# Altium schematic sheet PHY.SchDoc: NanoBoard Ethernet Add-On
size C; DocumentNumber: 1; SheetNumber: 1; SheetTotal: 1
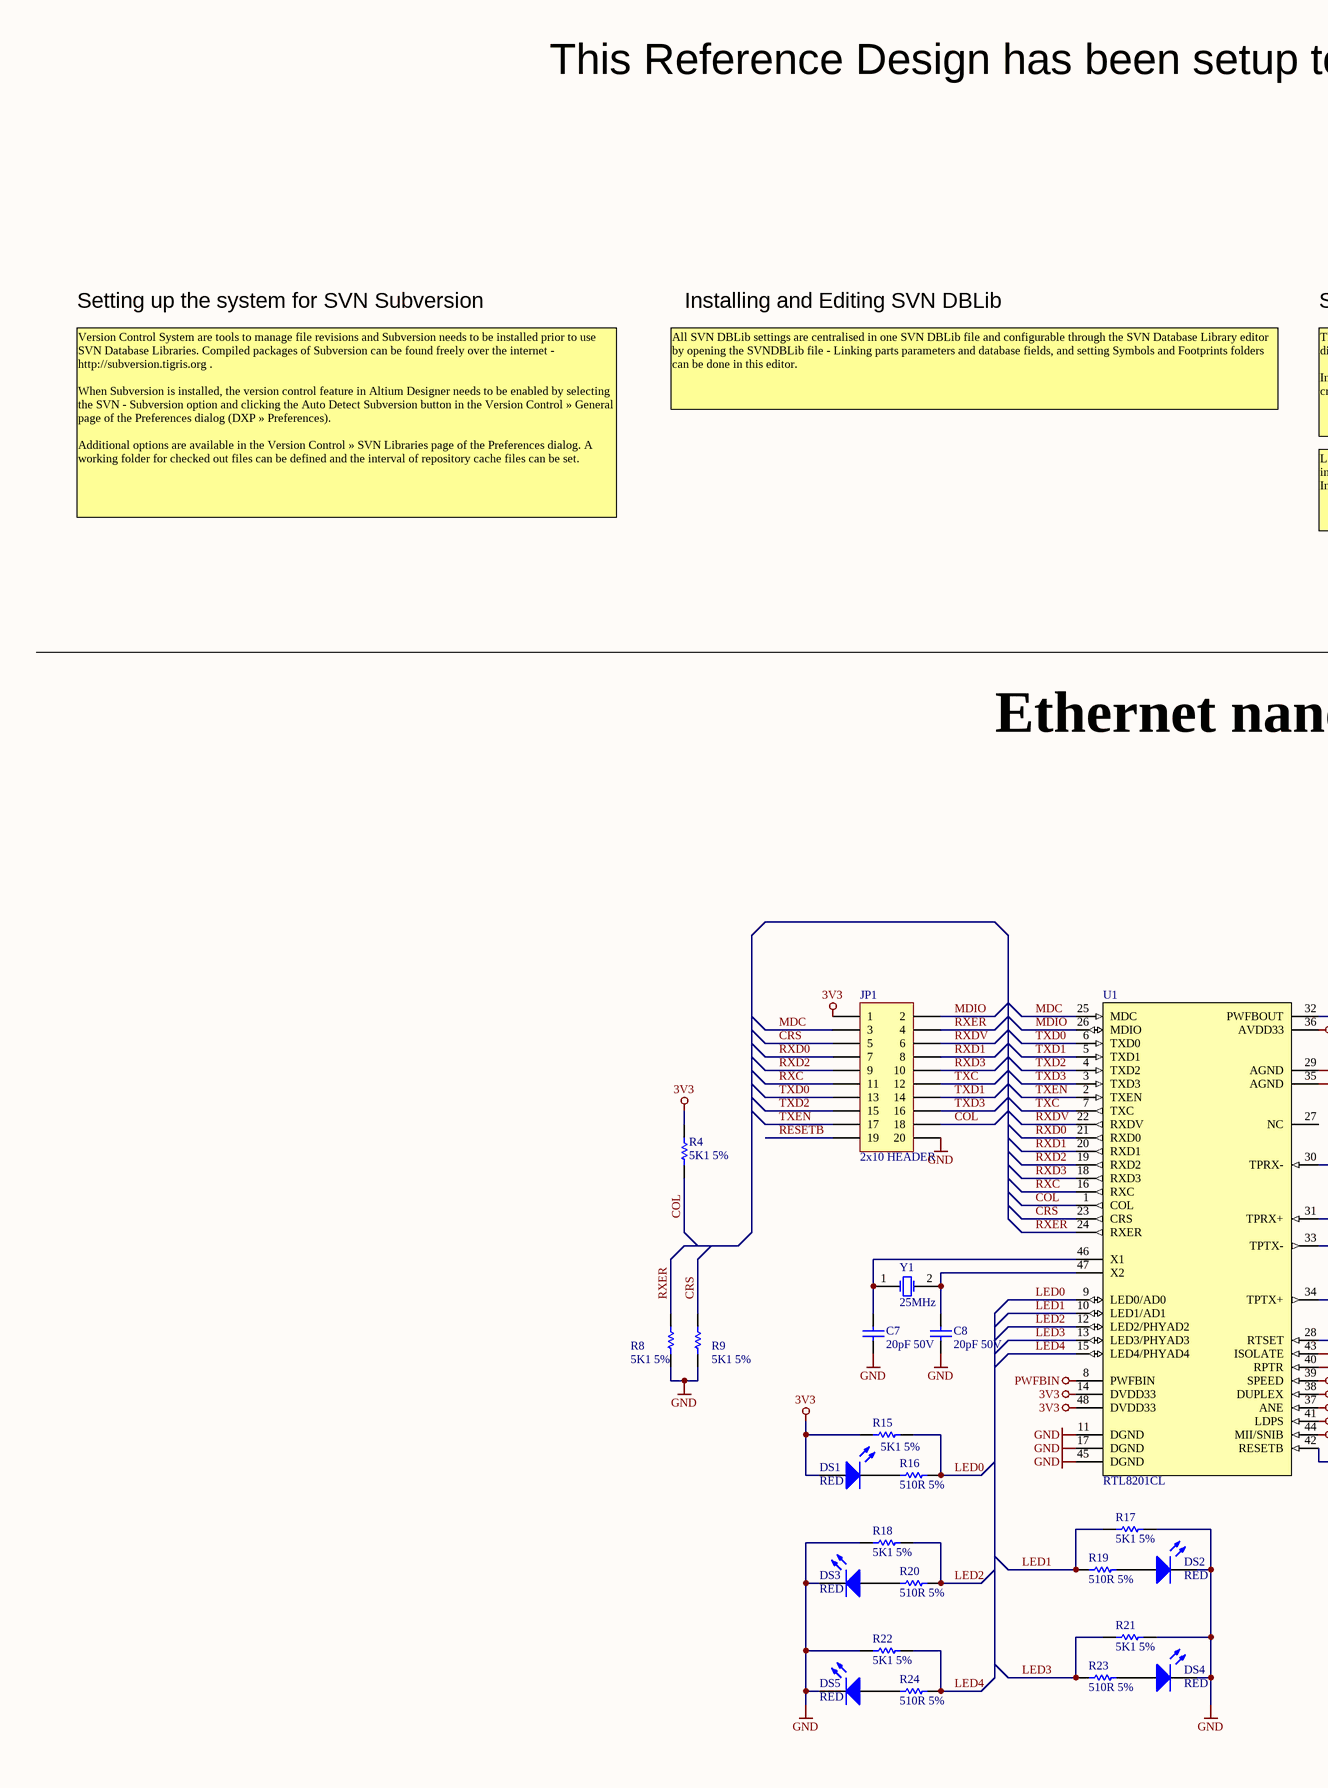
[diagram p0: PHY.SchDoc, left]
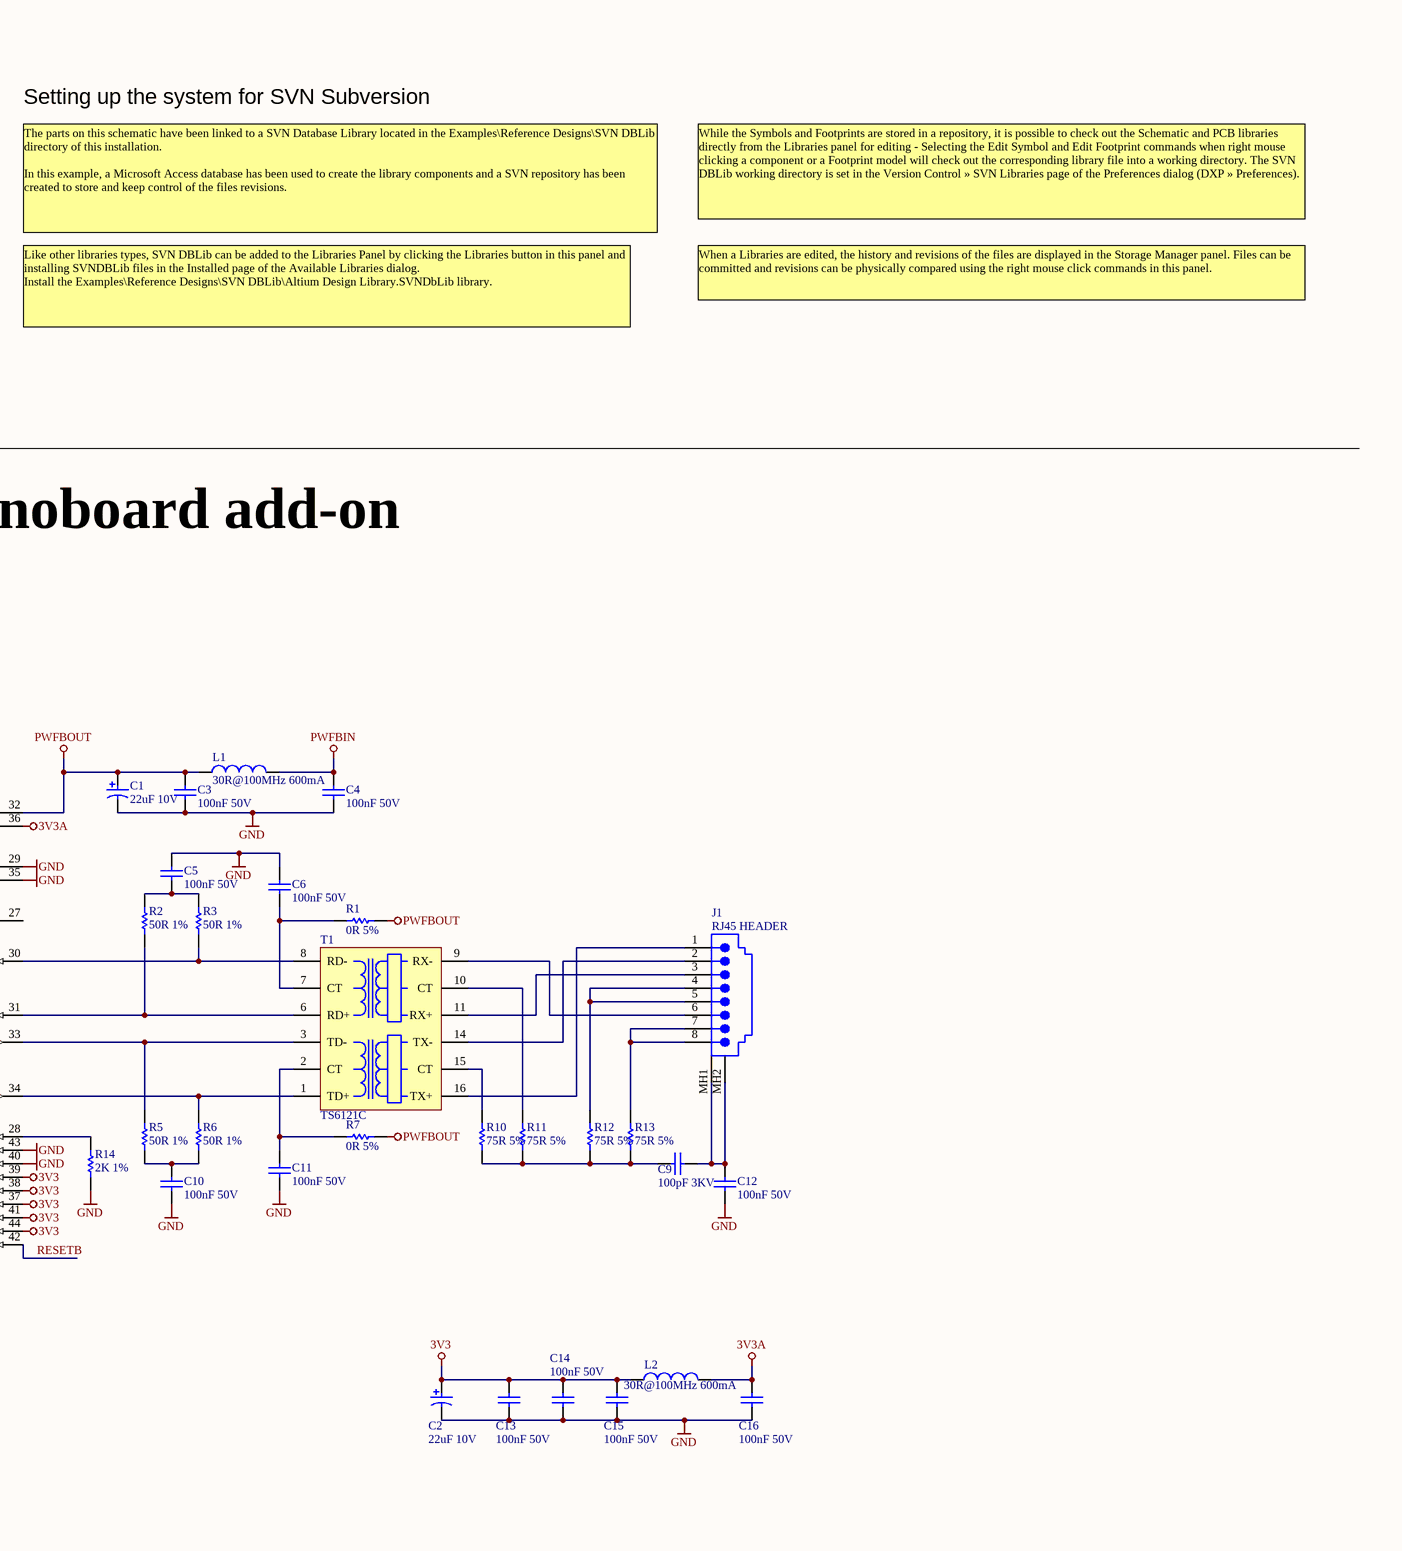
[diagram p1: PHY.SchDoc, right]

## Parts
C1  22uF 10V  [CAPC3528]
C2  22uF 10V  [CAPC3528]
C3  100nF 50V  [CAPC2012]
C4  100nF 50V  [CAPC2012]
C5  100nF 50V  [CAPC2012]
C6  100nF 50V  [CAPC2012]
C7  20pF 50V  [CAPC2012]
C8  20pF 50V  [CAPC2012]
C9  100pF 3KV  [CAPR7_5-3_6x7_5]
C10  100nF 50V  [CAPC2012]
C11  100nF 50V  [CAPC2012]
C12  100nF 50V  [CAPC2012]
C13  100nF 50V  [CAPC2012]
C14  100nF 50V  [CAPC2012]
C15  100nF 50V  [CAPC2012]
C16  100nF 50V  [CAPC2012]
DS1  RED  [LED2013]
DS2  RED  [LED2013]
DS3  RED  [LED2013]
DS4  RED  [LED2013]
DS5  RED  [LED2013]
J1  RJ45 HEADER  [95122-2881]
JP1  2x10 HEADER  [HDR2X10]
L1  30R@100MHz 600mA  [INDC2012]
L2  30R@100MHz 600mA  [INDC2012]
R1  0R 5%  [RESC2012]
R2  50R 1%  [RESC2012]
R3  50R 1%  [RESC2012]
R4  5K1 5%  [RESC2012]
R5  50R 1%  [RESC2012]
R6  50R 1%  [RESC2012]
R7  0R 5%  [RESC2012]
R8  5K1 5%  [RESC2012]
R9  5K1 5%  [RESC2012]
R10  75R 5%  [RESC2012]
R11  75R 5%  [RESC2012]
R12  75R 5%  [RESC2012]
R13  75R 5%  [RESC2012]
R14  2K 1%  [RESC2012]
R15  5K1 5%  [RESC2012]
R16  510R 5%  [RESC2012]
R17  5K1 5%  [RESC2012]
R18  5K1 5%  [RESC2012]
R19  510R 5%  [RESC2012]
R20  510R 5%  [RESC2012]
R21  5K1 5%  [RESC2012]
R22  5K1 5%  [RESC2012]
R23  510R 5%  [RESC2012]
R24  510R 5%  [RESC2012]
T1  TS6121C  [SOIC127P910-16]
U1  RTL8201CL  [TSQFP50P900X900-48]
Y1  25MHz  [XTAL_HC49SMD 20Mhz  +/-30ppm 20pf]

## Nets
3V3: C2.1 C13.2 C14.2 C15.2 DS1.1(A) JP1.1 L2.1 R4.2 R15.2 U1.14(DVDD33) U1.37(ANE) U1.38(DUPLEX) U1.39(SPEED) U1.41(LDPS) U1.44(MII/SNIB) U1.48(DVDD33)
3V3A: C16.2 L2.2 U1.36(AVDD33)
GND: C1.2 C2.2 C3.1 C4.1 C5.2 C6.1 C7.1 C8.1 C10.1 C11.1 C12.1 C13.1 C14.1 C15.1 C16.1 DS2.2(K) DS3.2(K) DS4.2(K) DS5.2(K) JP1.20 R8.1 R9.1 R14.1 R17.1 R18.2 R21.1 R22.2 U1.11(DGND) U1.17(DGND) U1.29(AGND) U1.35(AGND) U1.40(RPTR) U1.43(ISOLATE) U1.45(DGND)
PWFBIN: C4.2 L1.2 U1.8(PWFBIN)
PWFBOUT: C1.1 C3.2 L1.1 R1.2 R7.2 U1.32(PWFBOUT)
COL: JP1.18 R4.1 U1.1(COL)
CRS: JP1.5 R9.2 U1.23(CRS)
LED0: R15.1 R16.1 U1.9(LED0/AD0)
LED1: R17.2 R19.1 U1.10(LED1/AD1)
LED2: R18.1 R20.1 U1.12(LED2/PHYAD2)
LED3: R21.2 R23.1 U1.13(LED3/PHYAD3)
LED4: R22.1 R24.1 U1.15(LED4/PHYAD4)
MDC: JP1.3 U1.25(MDC)
MDIO: JP1.2 U1.26(MDIO)
RESETB: JP1.19 U1.42(RESETB)
RXC: JP1.11 U1.16(RXC)
RXD0: JP1.7 U1.21(RXD0)
RXD1: JP1.8 U1.20(RXD1)
RXD2: JP1.9 U1.19(RXD2)
RXD3: JP1.10 U1.18(RXD3)
RXDV: JP1.6 U1.22(RXDV)
RXER: JP1.4 R8.2 U1.24(RXER)
TXC: JP1.12 U1.7(TXC)
TXD0: JP1.13 U1.6(TXD0)
TXD1: JP1.14 U1.5(TXD1)
TXD2: JP1.15 U1.4(TXD2)
TXD3: JP1.16 U1.3(TXD3)
TXEN: JP1.17 U1.2(TXEN)
NetC5_1: C5.1 R2.2 R3.2
NetC6_2: C6.2 R1.1 T1.7(CT)
NetC7_2: C7.2 U1.46(X1) Y1.1(OSC1)
NetC8_2: C8.2 U1.47(X2) Y1.2(OSC2)
NetC9_1: C9.1 R10.1 R11.1 R12.1 R13.1
NetC9_2: C9.2 C12.2 J1.MH1(Shield) J1.MH2(Shield)
NetC10_2: C10.2 R5.1 R6.1
NetC11_2: C11.2 R7.1 T1.2(CT)
NetDS1_2: DS1.2(K) R16.2
NetDS2_1: DS2.1(A) R19.2
NetDS3_1: DS3.1(A) R20.2
NetDS4_1: DS4.1(A) R23.2
NetDS5_1: DS5.1(A) R24.2
NetJ1_1: J1.1 T1.16(TX+)
NetJ1_2: J1.2 T1.14(TX-)
NetJ1_3: J1.3 T1.11(RX+)
NetJ1_4: J1.4 J1.5 R12.2
NetJ1_6: J1.6 T1.9(RX-)
NetJ1_7: J1.7 J1.8 R13.2
NetR2_1: R2.1 T1.6(RD+) U1.31(TPRX+)
NetR3_1: R3.1 T1.8(RD-) U1.30(TPRX-)
NetR5_2: R5.2 T1.3(TD-) U1.33(TPTX-)
NetR6_2: R6.2 T1.1(TD+) U1.34(TPTX+)
NetR10_2: R10.2 T1.15(CT)
NetR11_2: R11.2 T1.10(CT)
NetR14_2: R14.2 U1.28(RTSET)

Not connected (* = marked no-connect by the designer): U1 27(NC)

## Notes on the sheet
- This Reference Design has been setup to illustrate the use of SVN DBLib in Altium Designer.
- Setting up the system for SVN Subversion
- Installing and Editing SVN DBLib
- All SVN DBLib settings are centralised in one SVN DBLib file and configurable through the SVN Database Library editor by opening the SVNDBLib file - Linking parts parameters and database fields, and setting Symbols and Footprints folders can be done in this editor.
- The parts on this schematic have been linked to a SVN Database Library located in the Examples\Reference Designs\SVN DBLib directory of this installation.
  In this example, a Microsoft Access database has been used to create the library components and a SVN repository has been created to store and keep control of the files revisions.
- While the Symbols and Footprints are stored in a repository, it is possible to check out the Schematic and PCB libraries directly from the Libraries panel for editing - Selecting the Edit Symbol and Edit Footprint commands when right mouse clicking a component or a Footprint model will check out the corresponding library file into a working directory. The SVN DBLib working directory is set in the Version Control » SVN Libraries page of the Preferences dialog (DXP » Preferences).
- Version Control System are tools to manage file revisions and Subversion needs to be installed prior to use SVN Database Libraries. Compiled packages of Subversion can be found freely over the internet - http://subversion.tigris.org .
  When Subversion is installed, the version control feature in Altium Designer needs to be enabled by selecting the SVN - Subversion option and clicking the Auto Detect Subversion button in the Version Control » General page of the Preferences dialog (DXP » Preferences).
  Additional options are available in the Version Control » SVN Libraries page of the Preferences dialog. A working folder for checked out files can be defined and the interval of repository cache files can be set.
- When a Libraries are edited, the history and revisions of the files are displayed in the Storage Manager panel. Files can be committed and revisions can be physically compared using the right mouse click commands in this panel.
- Like other libraries types, SVN DBLib can be added to the Libraries Panel by clicking the Libraries button in this panel and installing SVNDBLib files in the Installed page of the Available Libraries dialog.
  Install the Examples\Reference Designs\SVN DBLib\Altium Design Library.SVNDbLib library.
- Ethernet nanoboard add-on
- Title
- Size:
- Date:
- File:
- C
- Number:
- Time:
- Revision:
- Sheet
- of

## Library data of the parts
C1 C2 = CAP-P: Polar Capacitor; Design Item Id: CAP-P-22uF-10V-MCCT-B
C3-C16 = CAP-NP: Capacitor
  C3-C6 C10-C16: Design Item Id: CAP-NP-100nF-50V-0805
  C7 C8: Design Item Id: CAP-NP-20pF-50V-0805
  C9: Design Item Id: CAP-NP-100pF-3KV-CAPR7.5-3.6x7.5
DS1-DS5 = DIO-LED-1S: Typical GREEN SMD LED Agilent make; Design Item Id: LED-RED-HSMHC170
J1 = CON-RJ45-10-RA: Right Angle, Standard Profile, External Shield PCB Jack; Design Item Id: CON-RA-RJ45-95122-2881
JP1 = CON-HDR-2x10-STR: Header, 10-Pin, Dual row; Design Item Id: CON-HDRSTR-10x2-2.54mm
L1 L2 = IND-FER: Ferrite Bead; Design Item Id: IND-FER-30R@100MHz-600mA
R1-R24 = RES: Resistor
  R1 R7: Design Item Id: RES-0R-0805
  R2 R3 R5 R6: Design Item Id: RES-50R-1%-0805
  R4 R8 R9 R15 R17 R18 R21 R22: Design Item Id: RES-5K1-0805
  R10-R13: Design Item Id: RES-75R-0805
  R14: Design Item Id: RES-2K-1%-0805
  R16 R19 R20 R23 R24: Design Item Id: RES-510R-0805
T1 = TS6121C: Bothhand 10/100 BaseT Pulse Transformer; Design Item Id: TS6121C
U1 = RTL8201CL: Realtek Ethernet PHY tranceiver; Design Item Id: RTL8201CL
Y1 = CRYS: Surface Mount Crystal; Design Item Id: CRYS-25MHz-QC49